# EAGLE schematic tlc5947-breakout (EAGLE 5.10)
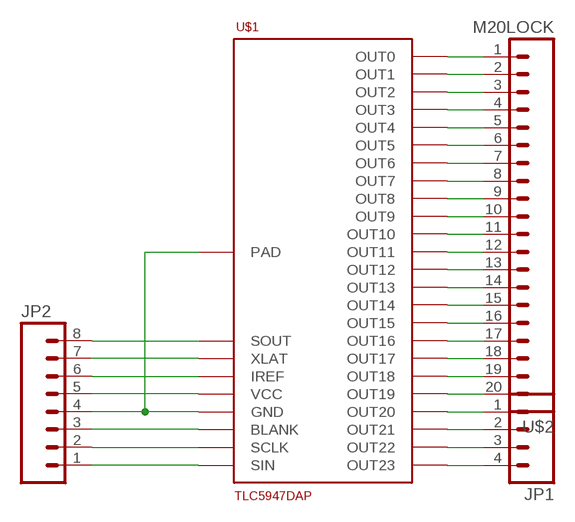
[diagram p0: schematic, sheet 1]

## Parts
JP1  M04LOCK  [1X04_LOCK]
JP2  M08LOCK  [1X08_LOCK]
U$1  TLC5947DAP  [HTSSOP32DAP]
U$2  M20LOCK  [1X20_LOCK]

## Nets
N$1: U$1.16(OUT11) U$2.12
N$2: U$1.15(OUT10) U$2.11
N$3: U$1.14(OUT9) U$2.10
N$4: U$1.13(OUT8) U$2.9
N$5: U$1.12(OUT7) U$2.8
N$6: U$1.11(OUT6) U$2.7
N$7: U$1.10(OUT5) U$2.6
N$8: U$1.9(OUT4) U$2.5
N$9: U$1.8(OUT3) U$2.4
N$10: U$1.7(OUT2) U$2.3
N$11: U$1.6(OUT1) U$2.2
N$12: U$1.5(OUT0) U$2.1
N$13: U$1.17(OUT12) U$2.13
N$14: U$1.18(OUT13) U$2.14
N$15: U$1.19(OUT14) U$2.15
N$16: U$1.20(OUT15) U$2.16
N$17: U$1.21(OUT16) U$2.17
N$18: U$1.22(OUT17) U$2.18
N$19: U$1.23(OUT18) U$2.19
N$20: U$1.24(OUT19) U$2.20
N$21: JP1.1 U$1.25(OUT20)
N$22: JP1.2 U$1.26(OUT21)
N$23: JP1.3 U$1.27(OUT22)
N$24: JP1.4 U$1.28(OUT23)
N$25: JP2.8 U$1.29(SOUT)
N$26: JP2.7 U$1.30(XLAT)
N$27: JP2.6 U$1.31(IREF)
N$28: JP2.4 U$1.1(GND) U$1.EXP(PAD)
N$29: JP2.1 U$1.4(SIN)
N$30: JP2.5 U$1.32(VCC)
N$31: JP2.3 U$1.2(BLANK)
N$32: JP2.2 U$1.3(SCLK)

## Library data of the parts
JP1 = SparkFun:M04: Header 4 Standard 4-pin 0.1" header. Use with straight break away headers (SKU : PRT-00116), right angle break away headers (PRT-00553), swiss pins (PRT-00743), machine pins (PRT-00117), and female headers (PRT-00115). Molex polarized connector foot print use with SKU : PRT-08231 with associated crimp pins and housings.
JP2 = SparkFun:M08: Header 8 Standard 8-pin 0.1" header. Use with straight break away headers (SKU : PRT-00116), right angle break away headers (PRT-00553), swiss pins (PRT-00743), machine pins (PRT-00117), and female headers (PRT-00115).
U$1 = ideabot:TLC5947
U$2 = SparkFun:M20: This is just like the LOCK variant in that the holes are staggared by 5 mil, but except for the last two holes. They are not altered from the "standard" footprint layout. This is used for a special purpose on the layout of our Graphic LCD Backpack. Make sure you want to use this device before selecting it for you project!